# EAGLE schematic ADS1248_BBB (EAGLE 6.5.0)
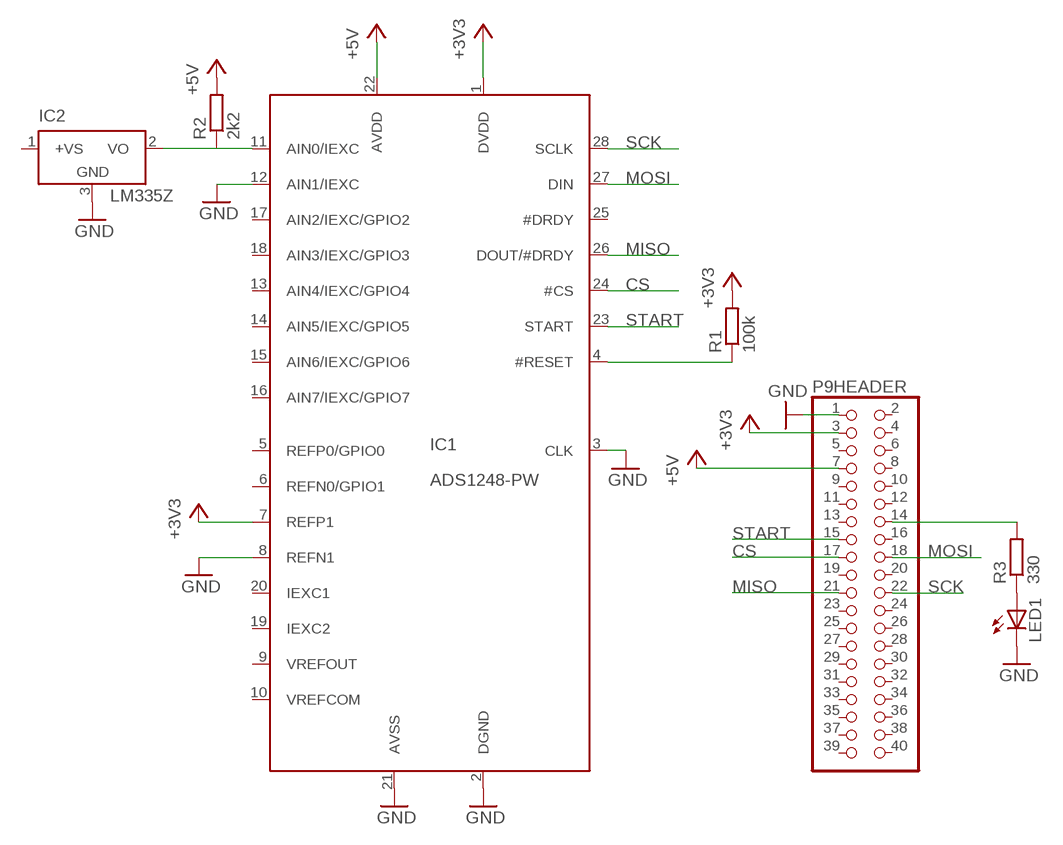
[diagram p0: schematic, sheet 1]

## Parts
IC1  ADS1248-PW  [TSSOP28]
IC2  LM335Z  LM35CZ  [TO92]
LED1  LED3MM  [LED3MM]
P9HEADER  PINHD-2X20  [2X20]
R1  100k  R-EU_0204/7  [0204/7]
R2  2k2  R-EU_0204/7  [0204/7]
R3  330  R-EU_0204/7  [0204/7]

## Nets
+3V3: IC1.1(DVDD) IC1.7(REFP1) P9HEADER.3 R1.2
+5V: IC1.22(AVDD) P9HEADER.7 R2.2
CS: IC1.24(#CS) P9HEADER.17
GND: IC1.2(DGND) IC1.3(CLK) IC1.8(REFN1) IC1.12(AIN1/IEXC) IC1.21(AVSS) IC2.3(GND) LED1.K(C) P9HEADER.1
MISO: IC1.26(DOUT/#DRDY) P9HEADER.21
MOSI: IC1.27(DIN) P9HEADER.18
N$1: IC1.4(#RESET) R1.1
N$2: IC1.11(AIN0/IEXC) IC2.2(VO) R2.1
N$3: P9HEADER.14 R3.2
N$4: LED1.A R3.1
SCK: IC1.28(SCLK) P9HEADER.22
START: IC1.23(START) P9HEADER.15
Unconnected: IC1.5(REFP0/GPIO0) IC1.6(REFN0/GPIO1) IC1.9(VREFOUT) IC1.10(VREFCOM) IC1.13(AIN4/IEXC/GPIO4) IC1.14(AIN5/IEXC/GPIO5) IC1.15(AIN6/IEXC/GPIO6) IC1.16(AIN7/IEXC/GPIO7) IC1.17(AIN2/IEXC/GPIO2) IC1.18(AIN3/IEXC/GPIO3) IC1.19(IEXC2) IC1.20(IEXC1) IC1.25(#DRDY) IC2.1(+VS) P9HEADER.2 P9HEADER.4 P9HEADER.5 P9HEADER.6 P9HEADER.8 P9HEADER.9 P9HEADER.10 P9HEADER.11 P9HEADER.12 P9HEADER.13 P9HEADER.16 P9HEADER.19 P9HEADER.20 P9HEADER.23 P9HEADER.24 P9HEADER.25 P9HEADER.26 P9HEADER.27 P9HEADER.28 P9HEADER.29 P9HEADER.30 P9HEADER.31 P9HEADER.32 P9HEADER.33 P9HEADER.34 P9HEADER.35 P9HEADER.36 P9HEADER.37 P9HEADER.38 P9HEADER.39 P9HEADER.40

## Library data of the parts
IC1 = ADS1248:ADS1248
IC2 = lm35:LM35: Single-Supply Centigrade Temperature Sensor Vout = (10mV/°C x Temp °C) +5mmmV Source: http://www.national.com/ds/LM/LM35.pdf
LED1 = led:LED: LED OSRAM: - CHIPLED LG R971, LG N971, LY N971, LG Q971, LY Q971, LO R971, LY R971 LH N974, LH R974 LS Q976, LO Q976, LY Q976 LO Q996 - Hyper CHIPLED LW Q18S LB Q993, LB Q99A, LB R99A - SideLED LS A670, LO A670, LY A670, LG A670, LP A670 LB A673, LV A673, LT A673, LW A673 LH A674 LY A675 LS A676, LA A676, LO A676, LY A676, LW A676 LS A679, LY A679, LG A679 - Hyper Micro SIDELED® LS Y876, LA Y876, LO Y876, LY Y876 LT Y87S - SmartLED LW L88C, LW L88S LB L89C, LB L89S, LG L890 LS L89K, LO L89K, LY L89K LS L896, LA L896, LO L896, LY L896 - TOPLED LS T670, LO T670, LY T670, LG T670, LP T670 LSG T670, LSP T670, LSY T670, LOP T670, LYG T670 LG T671, LOG T671, LSG T671 LB T673, LV T673, LT T673, LW T673 LH T674 LS T676, LA T676, LO T676, LY T676, LB T676, LH T676, LSB T676, LW T676 LB T67C, LV T67C, LT T67C, LS T67K, LO T67K, LY T67K, LW E67C LS E67B, LA E67B, LO E67B, LY E67B, LB E67C, LV E67C, LT E67C LW T67C LS T679, LY T679, LG T679 LS T770, LO T770, LY T770, LG T770, LP T770 LB T773, LV T773, LT T773, LW T773 LH T774 LS E675, LA E675, LY E675, LS T675 LS T776, LA T776, LO T776, LY T776, LB T776 LHGB T686 LT T68C, LB T68C - Hyper Mini TOPLED® LB M676 - Mini TOPLED Santana® LG M470 LS M47K, LO M47K, LY M47K Source: http://www.osram.convergy.de LUXEON: - LUMILED® LXK2-PW12-R00, LXK2-PW12-S00, LXK2-PW14-U00, LXK2-PW14-V00 LXK2-PM12-R00, LXK2-PM12-S00, LXK2-PM14-U00 LXK2-PE12-Q00, LXK2-PE12-R00, LXK2-PE12-S00, LXK2-PE14-T00, LXK2-PE14-U00 LXK2-PB12-K00, LXK2-PB12-L00, LXK2-PB12-M00, LXK2-PB14-N00, LXK2-PB14-P00, LXK2-PB14-Q00 LXK2-PR12-L00, LXK2-PR12-M00, LXK2-PR14-Q00, LXK2-PR14-R00 LXK2-PD12-Q00, LXK2-PD12-R00, LXK2-PD12-S00 LXK2-PH12-R00, LXK2-PH12-S00 LXK2-PL12-P00, LXK2-PL12-Q00, LXK2-PL12-R00 Source: www.luxeon.com KINGBRIGHT: KA-3528ASYC Source: www.kingbright.com
P9HEADER = pinhead:PINHD-2X20: PIN HEADER
R1-R3 = resistor:R-EU_: RESISTOR, European symbol